# Altium schematic sheet A6C.SchDoc
size A4
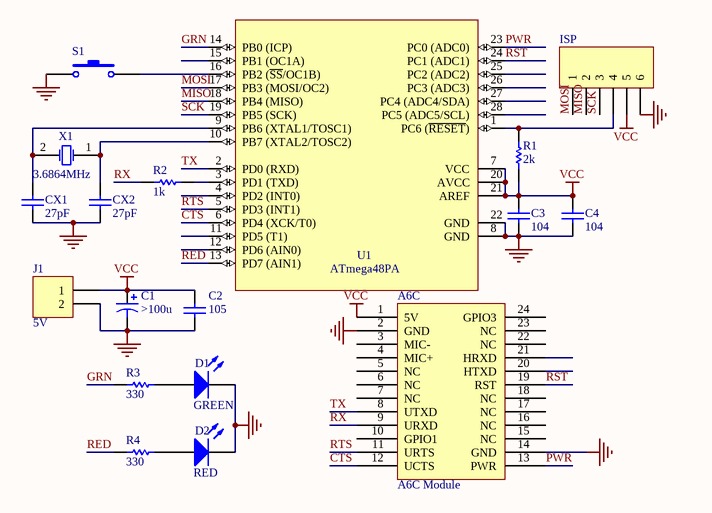
[diagram p0: A6C.SchDoc]

## Parts
A6C  A6C Module
C1  >100u  [RADIAL CAPACITOR - 1000uF]
C2  105  [RAD-0.1nar]
C3  104  [RAD-0.1nar]
C4  104  [RAD-0.1nar]
CX1  27pF  [RAD-0.1nar]
CX2  27pF  [RAD-0.1nar]
D1  GREEN  [LED-0]
D2  RED  [LED-0]
ISP  ISP  [PHOeNIX6]  (value not drawn)
J1  5V  [Phoenix2]
R1  2k  [aXIAL-0.4nar]
R2  1k  [aXIAL-0.4nar]
R3  330  [aXIAL-0.4nar]
R4  330  [aXIAL-0.4nar]
S1  SW-PB  [SPST-2]  (value not drawn)
U1  ATmega48PA  [My_28P3]
X1  3.6864MHz  [XTAL_1]

## Nets
GND: A6C.2(GND) A6C.14(GND) C1.2 C2.1 C3.2 C4.2 CX1.2 CX2.2 D1.2(K) D2.2(K) ISP.6 J1.2 S1.1 U1.8(GND) U1.22(GND)
VCC: A6C.1(5V) C1.1 C2.2 C3.1 C4.1 ISP.5 J1.1 R1.2 U1.7(VCC) U1.20(AVCC) U1.21(AREF)
CTS: A6C.12(UCTS) U1.6(PD4_(XCK/T0))
GRN: R3.1 U1.14(PB0_(ICP))
MISO: ISP.2 U1.18(PB4_(MISO))
MOSI: ISP.1 U1.17(PB3_(MOSI/OC2))
PWR: A6C.13(PWR) U1.23(PC0_(ADC0))
RED: R4.1 U1.13(PD7_(AIN1))
RST: A6C.19(RST) U1.24(PC1_(ADC1))
RTS: A6C.11(URTS) U1.5(PD3_(INT1))
RX: A6C.9(URXD) R2.1
SCK: ISP.3 U1.19(PB5_(SCK))
TX: A6C.8(UTXD) U1.2(PD0_(RXD))
NetCX1_1: CX1.1 U1.9(PB6_(XTAL1/TOSC1)) X1.2(OSC2)
NetCX2_1: CX2.1 U1.10(PB7_(XTAL2/TOSC2)) X1.1(OSC1)
NetD1_1: D1.1(A) R3.2
NetD2_1: D2.1(A) R4.2
NetISP_4: ISP.4 R1.1 U1.1(PC6_(~{RESET}))
NetR2_2: R2.2 U1.3(PD1_(TXD))
NetS1_2: S1.2 U1.16(PB2_(~{SS}/OC1B))

Not connected (* = marked no-connect by the designer): A6C 3(MIC-) 4(MIC+) 5(NC) 6(NC) 7(NC) 10(GPIO1) 15(NC) 16(NC) 17(NC) 18(NC) 20(HTXD) 21(HRXD) 22(NC) 23(NC) 24(GPIO3); U1 4(PD2_(INT0)) 11(PD5_(T1)) 12(PD6_(AIN0)) 15(PB1_(OC1A)) 25(PC2_(ADC2)) 26(PC3_(ADC3)) 27(PC4_(ADC4/SDA)) 28(PC5_(ADC5/SCL))

## Library data of the parts
A6C = Component_1
C1 = Cap Pol1: Polarized Capacitor (Radial); Published: 8-Jun-2000; LatestRevisionDate: 17-Jul-2002; LatestRevisionNote: Re-released for DXP Platform.; PackageReference: RB7.6-15; Publisher: Altium Limited; PackageDescription: Polarized Capacitor (Radial); 2 Leads; Value: >100u
C2-C4 CX1 CX2 = Cap: Capacitor; Published: 8-Jun-2000; LatestRevisionDate: 17-Jul-2002; LatestRevisionNote: Re-released for DXP Platform.; PackageReference: RAD-0.3; Publisher: Altium Limited; PackageDescription: Radial Cap, Thru-Hole; 2 Leads; 0.3 in Pin Spacing
  C2: Value: 105
  C3 C4: Value: 104
  CX1 CX2: Value: 27pF
D1 D2 = LED0: Typical INFRARED GaAs LED; Published: 8-Jun-2000; LatestRevisionDate: 08-Jul-2005; LatestRevisionNote: Mech Layer 1 removed.; PackageReference: LED-0; Publisher: Altium Limited; PackageDescription: LED; 2 Leads
ISP = Header 6: Header, 6-Pin; LatestRevisionDate: 17-Jul-2002; LatestRevisionNote: Re-released for DXP Platform.; Publisher: Altium Limited
J1 = Header 2: Header, 2-Pin; LatestRevisionDate: 17-Jul-2002; LatestRevisionNote: Re-released for DXP Platform.; Publisher: Altium Limited
R1-R4 = Res Semi: Semiconductor Resistor; Published: 8-Jun-2000; LatestRevisionDate: 17-Jul-2002; LatestRevisionNote: Re-released for DXP Platform.; PackageReference: AXIAL-0.5; Publisher: Altium Limited; PackageDescription: Axial Device, Thru-Hole; 2 Leads; 0.5 in Pin Spacing
  R1: Value: 2k
  R2: Value: 1k
  R3 R4: Value: 330
S1 = SW-PB: Switch; Published: 24-Mar-1999; LatestRevisionDate: 17-Jul-2002; LatestRevisionNote: Re-released for DXP Platform.; PackageReference: SPST-2; Publisher: Altium Limited; PackageDescription: Switch; 2 Leads
U1 = ATmega8-16PI: AVR 8K Bytes of In-System Programmable Flash Memory; Published: 17-Sep-2003; LatestRevisionDate: 04-Mar-2005; LatestRevisionNote: Stylized 3D Model Added.; DatasheetVersion: 2486H-AVR-09/02; PackageVersion: revB, Sep-2001; PackageReference: 28P3; Publisher: Altium Limited; PackageDescription: DIP; 28 Leads; Row Spacing 7.62 mm; Pitch 2.54 mm; ComponentLink1Description: Manufacturer Link; ComponentLink1URL: http://www.atmel.com; ComponentLink2Description: Datasheet; ComponentLink2URL: http://www.atmel.com/dyn/resources/prod_documents/doc2486.pdf
X1 = XTAL: Crystal Oscillator; Published: 8-Jun-2000; LatestRevisionDate: 17-Jul-2002; LatestRevisionNote: Re-released for DXP Platform.; PackageReference: R38; Publisher: Altium Limited; PackageDescription: Crystal, Thru-Hole; 2 Leads; Body 3.1 x 8.2 mm (Dia.xH)